# EasyEDA schematic ShieldPi4_WS.json
TITLE: ShieldPi4_WS; REV: 1.0; Date: 2022-01-02; Sheet: 1/1; Company: www.fpagano.com
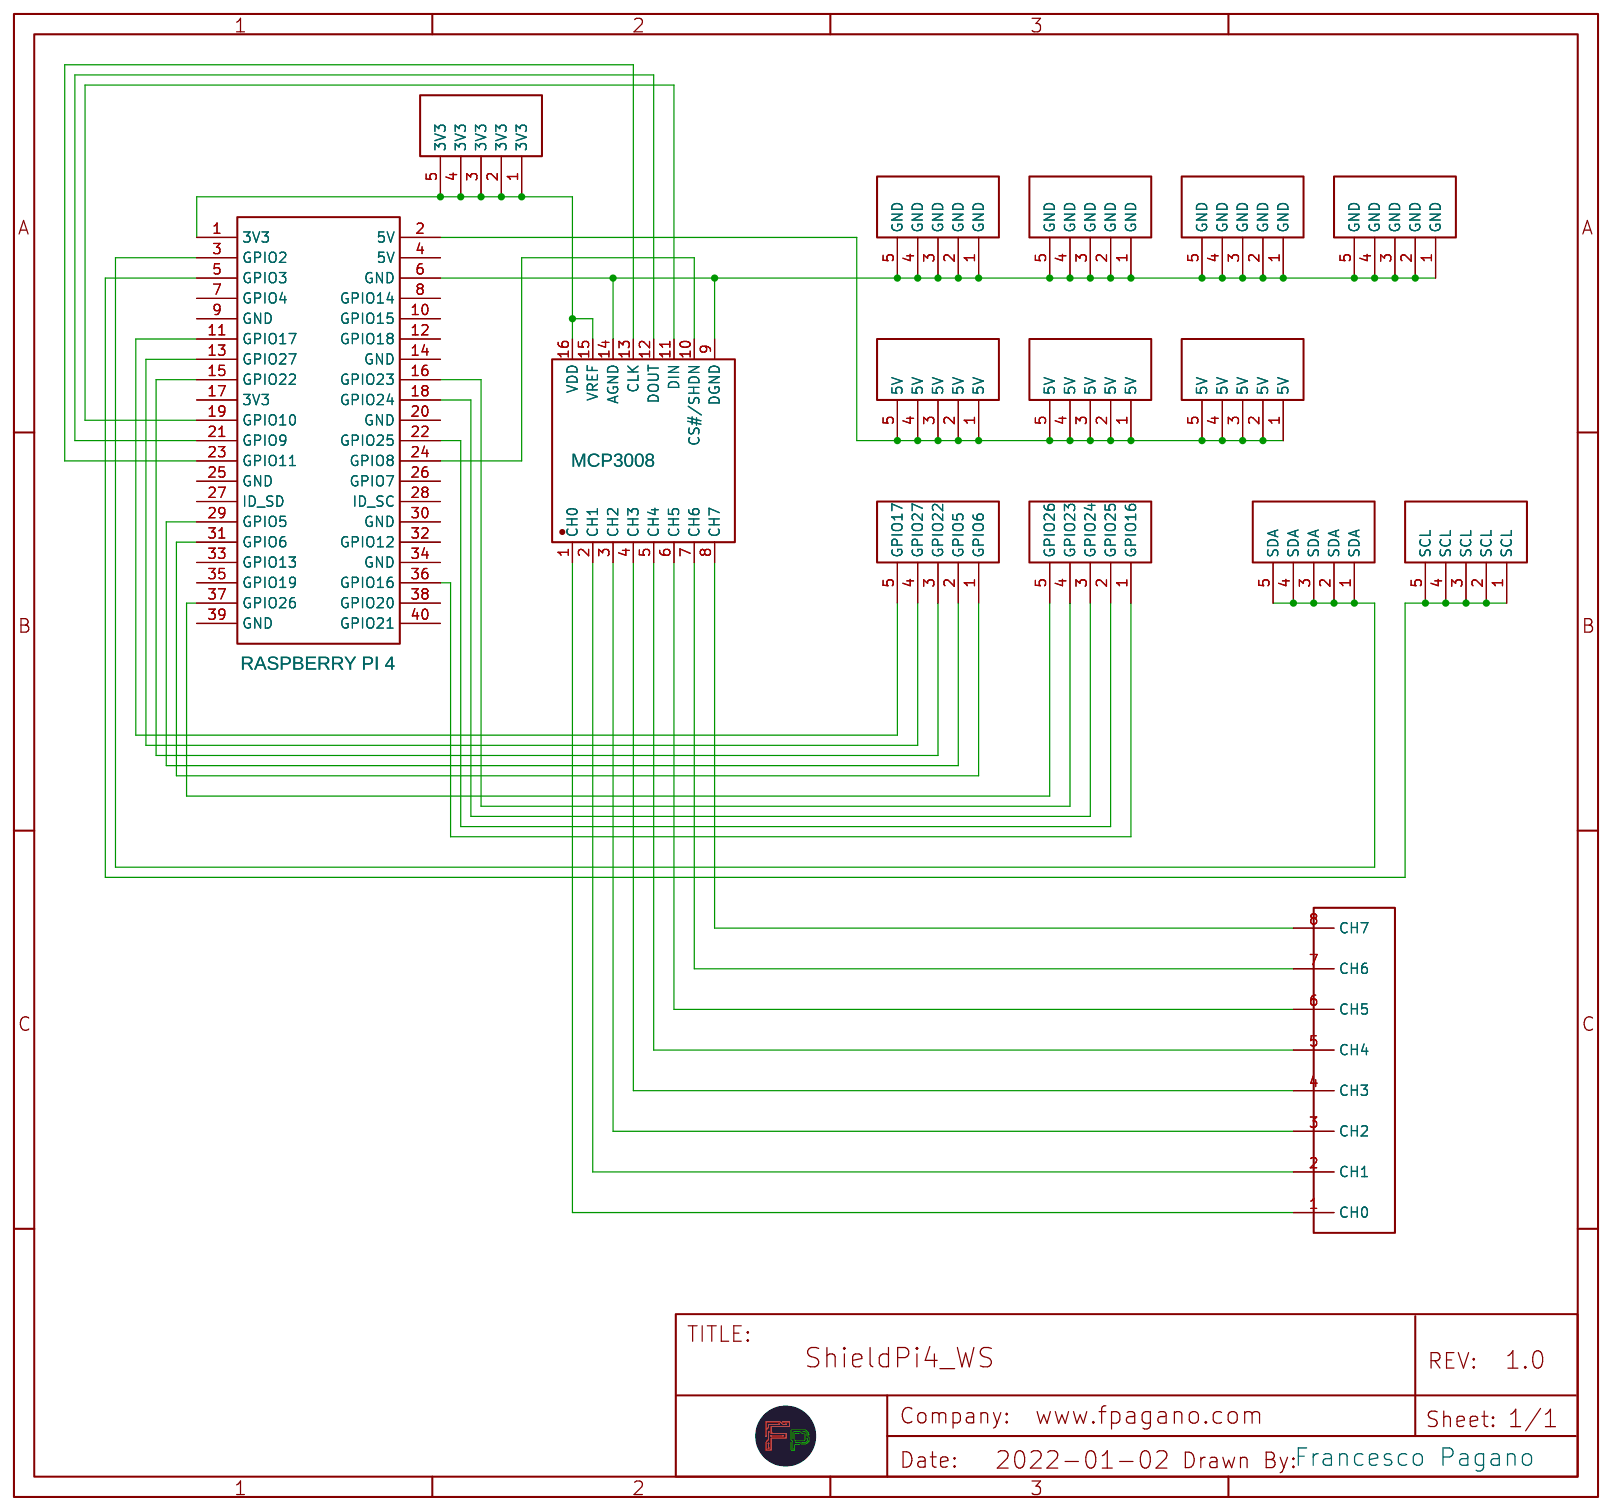
[diagram p0: schematic sheet]

## Parts
U1  RASPBERRY PI 4  [RASPBERRY PI 4]
U2  5 Pin Pinheader  [5 PIN PINHEADER]
U3  MCP3008  [PDIP-16_L19.3-W6.5-P2.54-LS7.6-BL]
U4  5 Pin Pinheader  [5 PIN PINHEADER]
U5  5 Pin Pinheader  [5 PIN PINHEADER]
U6  5 Pin Pinheader  [5 PIN PINHEADER]
U7  5 Pin Pinheader  [5 PIN PINHEADER]
U8  5 Pin Pinheader  [5 PIN PINHEADER]
U9  5 Pin Pinheader  [5 PIN PINHEADER]
U10  pinheader 2.54 - 8 pins  [PINHEADER 2.54 - 8 PINS]
U11  5 Pin Pinheader  [5 PIN PINHEADER]
U12  5 Pin Pinheader  [5 PIN PINHEADER]
U13  5 Pin Pinheader  [5 PIN PINHEADER]
U15  5 Pin Pinheader  [5 PIN PINHEADER]
U16  5 Pin Pinheader  [5 PIN PINHEADER]

## Library data of the parts
U1 = RASPBERRY PI 4: Contributor: KUTLUHAN ARSLAN; subpart_no: 2
U2 U4-U9 U11-U13 U15 U16 = 5 Pin Pinheader: Contributor: Snowcastle
U3 = MCP3008-I/P: Supplier: LCSC; Supplier Part: C2890491; Manufacturer: MICROCHIP(美国微芯); Contributor: LCSC
U10 = pinheader 2.54 - 8 pins: Contributor: candemir

## Nets
Net-(U1-1): U1.1(3V3) U3.15(VREF) U3.16(VDD) U15.1(3V3) U15.2(3V3) U15.3(3V3) U15.4(3V3) U15.5(3V3)
Net-(U1-2): U1.2(5V) U5.1(5V) U5.2(5V) U5.3(5V) U5.4(5V) U5.5(5V) U6.1(5V) U6.2(5V) U6.3(5V) U6.4(5V) U6.5(5V) U7.1(5V) U7.2(5V) U7.3(5V) U7.4(5V) U7.5(5V)
Net-(U1-3): U1.3(GPIO2) U13.1(SDA) U13.2(SDA) U13.3(SDA) U13.4(SDA) U13.5(SDA)
Net-(U1-5): U1.5(GPIO3) U12.1(SCL) U12.2(SCL) U12.3(SCL) U12.4(SCL) U12.5(SCL)
Net-(U1-6): U1.6(GND) U2.1(GND) U2.2(GND) U2.3(GND) U2.4(GND) U2.5(GND) U3.9(DGND) U3.14(AGND) U4.1(GND) U4.2(GND) U4.3(GND) U4.4(GND) U4.5(GND) U11.1(GND) U11.2(GND) U11.3(GND) U11.4(GND) U11.5(GND) U16.1(GND) U16.2(GND) U16.3(GND) U16.4(GND) U16.5(GND)
Net-(U1-11): U1.11(GPIO17) U8.5(GPIO17)
Net-(U1-13): U1.13(GPIO27) U8.4(GPIO27)
Net-(U1-15): U1.15(GPIO22) U8.3(GPIO22)
Net-(U1-16): U1.16(GPIO23) U9.4(GPIO23)
Net-(U1-18): U1.18(GPIO24) U9.3(GPIO24)
Net-(U1-19): U1.19(GPIO10) U3.11(DIN)
Net-(U1-21): U1.21(GPIO9) U3.12(DOUT)
Net-(U1-22): U1.22(GPIO25) U9.2(GPIO25)
Net-(U1-23): U1.23(GPIO11) U3.13(CLK)
Net-(U1-24): U1.24(GPIO8) U3.10(CS#/SHDN)
Net-(U1-29): U1.29(GPIO5) U8.2(GPIO5)
Net-(U1-31): U1.31(GPIO6) U8.1(GPIO6)
Net-(U1-36): U1.36(GPIO16) U9.1(GPIO16)
Net-(U1-37): U1.37(GPIO26) U9.5(GPIO26)
Net-(U3-1): U3.1(CH0) U10.1(CH0)
Net-(U3-2): U3.2(CH1) U10.2(CH1)
Net-(U3-3): U3.3(CH2) U10.3(CH2)
Net-(U3-4): U3.4(CH3) U10.4(CH3)
Net-(U3-5): U3.5(CH4) U10.5(CH4)
Net-(U3-6): U3.6(CH5) U10.6(CH5)
Net-(U3-7): U3.7(CH6) U10.7(CH6)
Net-(U3-8): U3.8(CH7) U10.8(CH7)

Not connected (* = marked no-connect by the designer): U1 4(5V) 7(GPIO4) 8(GPIO14) 9(GND) 10(GPIO15) 12(GPIO18) 14(GND) 17(3V3) 20(GND) 25(GND) 26(GPIO7) 27(ID_SD) 28(ID_SC) 30(GND) 32(GPIO12) 33(GPIO13) 34(GND) 35(GPIO19) 38(GPIO20) 39(GND) 40(GPIO21)

## Notes on the sheet
- Francesco Pagano
